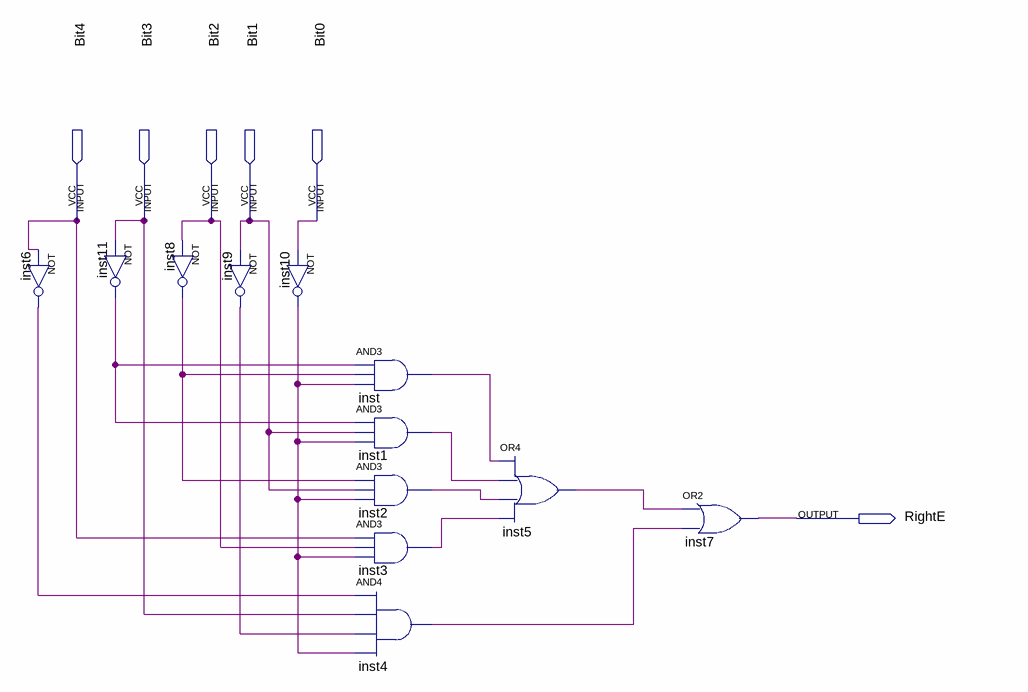
[diagram p0: schematic sheet]
// Quartus schematic RightE.bdf as structural Verilog: 12 symbols, 6 pins
module RightE (
  input  Bit4,
  input  Bit3,
  input  Bit2,
  input  Bit1,
  input  Bit0,
  output RightE
);

  wire inst1_out, inst2_out, inst3_out, inst4_out, inst5_out, inst6_out, inst8_out, inst9_out, inst10_out,
       inst11_out, inst_out;

  not inst6 (inst6_out, Bit4);
  not inst8 (inst8_out, Bit2);
  not inst11 (inst11_out, Bit3);
  not inst9 (inst9_out, Bit1);
  not inst10 (inst10_out, Bit0);
  and inst (inst_out, inst11_out, inst8_out, inst10_out);
  and inst1 (inst1_out, inst11_out, Bit1, inst10_out);
  and inst2 (inst2_out, inst8_out, Bit1, inst10_out);
  and inst3 (inst3_out, Bit4, Bit2, inst10_out);
  and inst4 (inst4_out, inst6_out, Bit3, inst9_out, inst10_out);
  or inst5 (inst5_out, inst_out, inst1_out, inst2_out, inst3_out);
  or inst7 (RightE, inst5_out, inst4_out);
endmodule
